# Altium schematic sheet Main.SchDoc
size A4; SheetNumber: 1; SheetTotal: 1
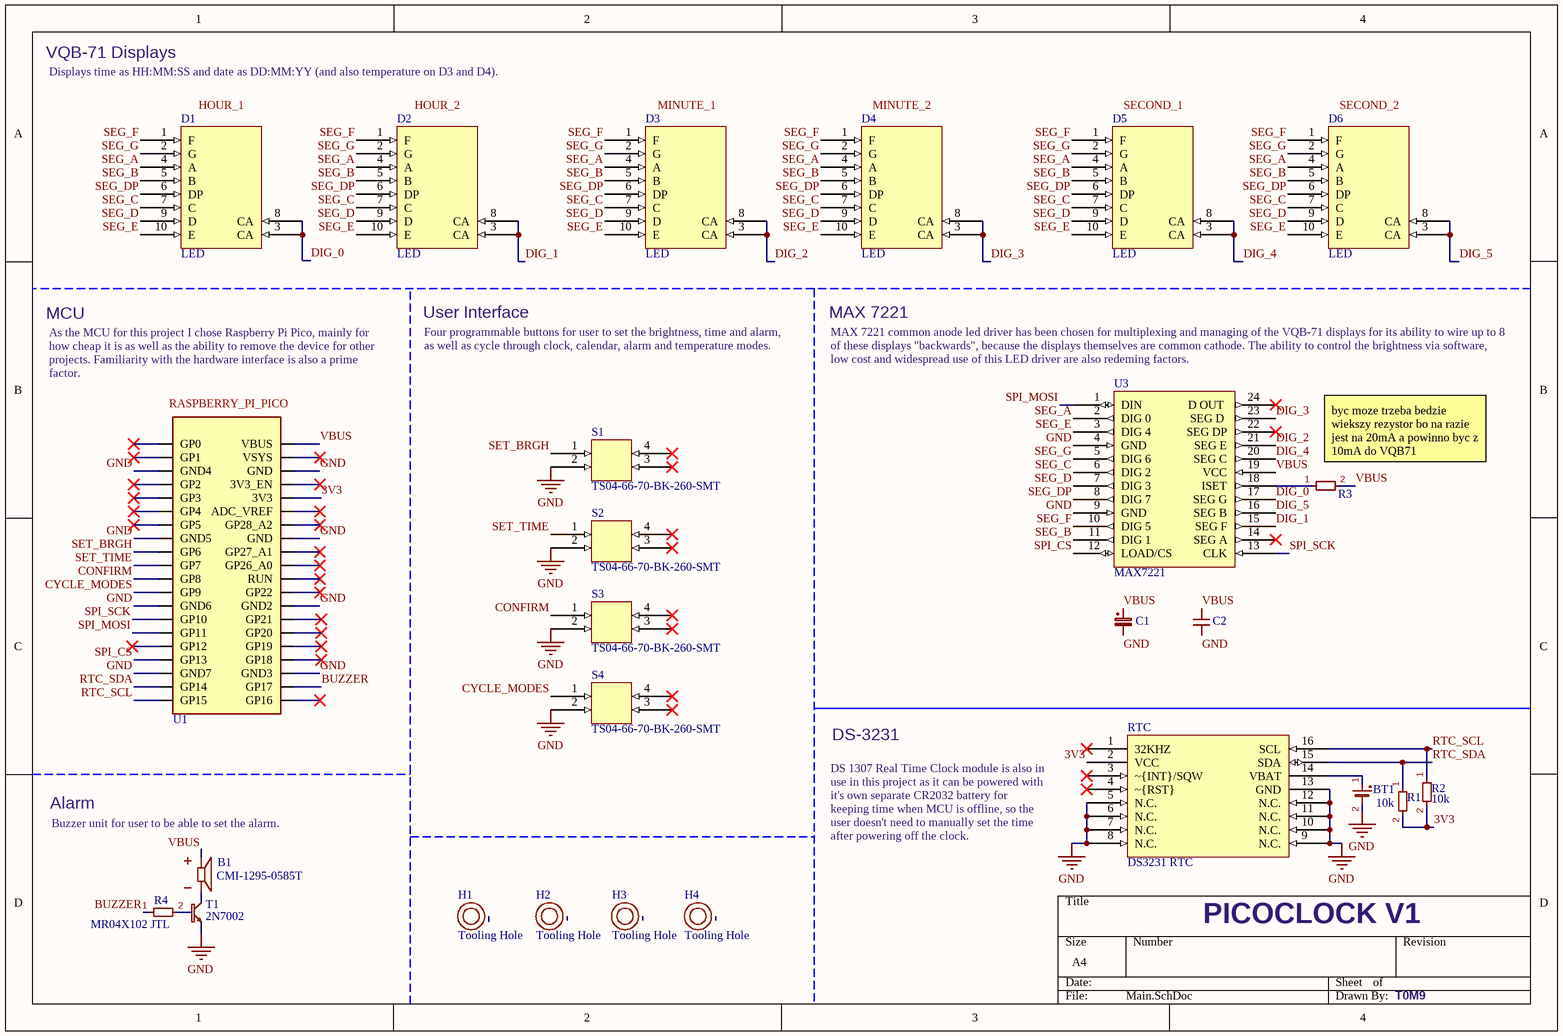
[diagram p0: Main.SchDoc]

## Parts
B1  CMI-1295-0585T  [CMI-1295-0585T]
BT1  Keystone 3034 BH  [BAT_3034TR]  (value not drawn)
C1  Electrolitic Capacitor 10uF  [CAPC2012X145N]  (value not drawn)
C2  UMK105B7104KVHF  [UMK105B7104KVHF]  (value not drawn)
D1  LED  [LED_INND-TS56RAB]
D2  LED  [LED_INND-TS56RAB]
D3  LED  [LED_INND-TS56RAB]
D4  LED  [LED_INND-TS56RAB]
D5  LED  [LED_INND-TS56RAB]
D6  LED  [LED_INND-TS56RAB]
H1  Tooling Hole  [Tooling Hole]
H2  Tooling Hole  [Tooling Hole]
H3  Tooling Hole  [Tooling Hole]
H4  Tooling Hole  [Tooling Hole]
R1  10k  [MR04X102 JTL]
R2  10k  [MR04X102 JTL]
R3  CRCW040221K0FKEDC  [CRCW040221K0FKEDC]  (value not drawn)
R4  MR04X102 JTL  [MR04X102 JTL]
RTC  DS3231 RTC  [DS3231 RTC]
S1  TS04-66-70-BK-260-SMT  [TS04-66-70-BK-260-SMT]
S2  TS04-66-70-BK-260-SMT  [TS04-66-70-BK-260-SMT]
S3  TS04-66-70-BK-260-SMT  [TS04-66-70-BK-260-SMT]
S4  TS04-66-70-BK-260-SMT  [TS04-66-70-BK-260-SMT]
T1  2N7002  [2N7002]
U1  RASPBERRY_PI_PICO  [RASPBERRY_PI_PICO]
U3  MAX7221  [MAX7221]

## Nets
GND: BT1.2 C1.2 C2.2 RTC.5(N.C.) RTC.6(N.C.) RTC.7(N.C.) RTC.8(N.C.) RTC.9(N.C.) RTC.10(N.C.) RTC.11(N.C.) RTC.12(N.C.) RTC.13(GND) S1.2 S2.2 S3.2 S4.2 T1.2(S) U1.GND U1.GND2 U1.GND3 U1.GND4 U1.GND5 U1.GND6 U1.GND7 U3.4(GND) U3.9(GND)
3V3: R1.2 R2.2 RTC.2(VCC) U1.3V3
BUZZER: R4.1 U1.GP17
CONFIRM: S3.1 U1.GP8
CYCLE_MODES: S4.1 U1.GP9
DIG_0: D1.3(CA) D1.8(CA) U3.17(SEG_G)
DIG_1: D2.3(CA) D2.8(CA) U3.15(SEG_F)
DIG_2: D3.3(CA) D3.8(CA) U3.21(SEG_E)
DIG_3: D4.3(CA) D4.8(CA) U3.23(SEG_D)
DIG_4: D5.3(CA) D5.8(CA) U3.20(SEG_C)
DIG_5: D6.3(CA) D6.8(CA) U3.16(SEG_B)
RTC_SCL: R2.1 RTC.16(SCL) U1.GP15
RTC_SDA: R1.1 RTC.15(SDA) U1.GP14
SEG_A: D1.4(A) D2.4(A) D3.4(A) D4.4(A) D5.4(A) D6.4(A) U3.2(DIG_0)
SEG_B: D1.5(B) D2.5(B) D3.5(B) D4.5(B) D5.5(B) D6.5(B) U3.11(DIG_1)
SEG_C: D1.7(C) D2.7(C) D3.7(C) D4.7(C) D5.7(C) D6.7(C) U3.6(DIG_2)
SEG_D: D1.9(D) D2.9(D) D3.9(D) D4.9(D) D5.9(D) D6.9(D) U3.7(DIG_3)
SEG_DP: D1.6(DP) D2.6(DP) D3.6(DP) D4.6(DP) D5.6(DP) D6.6(DP) U3.8(DIG_7)
SEG_E: D1.10(E) D2.10(E) D3.10(E) D4.10(E) D5.10(E) D6.10(E) U3.3(DIG_4)
SEG_F: D1.1(F) D2.1(F) D3.1(F) D4.1(F) D5.1(F) D6.1(F) U3.10(DIG_5)
SEG_G: D1.2(G) D2.2(G) D3.2(G) D4.2(G) D5.2(G) D6.2(G) U3.5(DIG_6)
SET_BRGH: S1.1 U1.GP6
SET_TIME: S2.1 U1.GP7
SPI_CS: U1.GP13 U3.12(LOAD/CS)
SPI_MOSI: U1.GP11 U3.1(DIN)
SPI_SCK: U1.GP10 U3.13(CLK)
VBUS: B1.P C1.1 C2.1 R3.2 U1.VBUS U3.19(VCC)
NetB1_N: B1.N T1.3(D)
NetBT1_1: BT1.1 RTC.14(VBAT)
NetR3_1: R3.1 U3.18(ISET)
NetR4_2: R4.2 T1.1(G)

Not connected (* = marked no-connect by the designer): RTC 1(32KHZ)* 3(~{INT}/SQW)* 4(~{RST})*; S1 3* 4*; S2 3* 4*; S3 3* 4*; S4 3* 4*; U1 3V3_EN* ADC_VREF* GP0* GP1* GP2* GP3* GP4* GP5* GP12* GP16* GP18* GP19* GP20* GP21* GP22* GP26_A0* GP27_A1* GP28_A2* RUN* VSYS*; U3 14(SEG_A)* 22(SEG_DP)* 24(D_OUT_)*

## Notes on the sheet
- VQB-71 Displays
- Displays time as HH:MM:SS and date as DD:MM:YY (and also temperature on D3 and D4).
- (near D1) HOUR_1
- (near D2) HOUR_2
- (near D3) MINUTE_1
- (near D4) MINUTE_2
- (near D5) SECOND_1
- (near D6) SECOND_2
- MCU
- As the MCU for this project I chose Raspberry Pi Pico, mainly for how cheap it is as well as the ability to remove the device for other projects. Familiarity with the hardware interface is also a prime factor.
- User Interface
- Four programmable buttons for user to set the brightness, time and alarm, as well as cycle through clock, calendar, alarm and temperature modes.
- MAX 7221
- (near U3) MAX 7221 common anode led driver has been chosen for multiplexing and managing of the VQB-71 displays for its ability to wire up to 8 of these displays "backwards", because the displays themselves are common cathode. The ability to control the brightness via software, low cost and widespread use of this LED driver are also redeming factors.
- (near R3) byc moze trzeba bedzie wiekszy rezystor bo na razie jest na 20mA a powinno byc z 10mA do VQB71
- DS-3231
- (near B1) Alarm
- (near B1) Buzzer unit for user to be able to set the alarm.
- DS 1307 Real Time Clock module is also in use in this project as it can be powered with it's own separate CR2032 battery for keeping time when MCU is offline, so the user doesn't need to manually set the time after powering off the clock.
- PICOCLOCK V1
- T0M9

## Library data of the parts
B1 = CMI-1295-0585T: Buzzer; ComponentLink1Description: New link; ComponentLink1URL: *
C1 = Electrolitic Capacitor 10uF: CGA4J1X7R0J106K125AC / 10u 6.3V 0805
C2 = UMK105B7104KVHF: 0.1uF
D1-D6 = LED: VQB-71
R1 R2 = ESR01MZPF1002
R3 = CRCW040221K0FKEDC: 21k
R4 = MR04X102 JTL: 1k
S1-S4 = TS04-66-70-BK-260-SMT: 50mA 12VDC; ComponentLink1Description: New link; ComponentLink1URL: https://www.mouser.pl/ProductDetail/Same-Sky/TS04-66-70-BK-260-SMT?qs=A6eO%252BMLsxmRC7sCjYvfBWA%3D%3D&mgh=1&vip=1&utm_id=20540008314&utm_source=google&utm_medium=cpc&utm_marketing_tactic=emeacorp&gad_source=1&gad_campaignid=20549663743&gbraid=0AAAAADn_wf3exhVZw2lg0M8R4AHAX7JAt&gclid=Cj0KCQjw9JLHBhC-ARIsAK4PhcrY2_4ccHUHvV6ZUo_WOC_S4ttDTQDRDZOP9uDgYmQccfZ3msk1KAwaApw5EALw_wcB
T1 = 2N7002: Transistor; ComponentLink1Description: New link; ComponentLink1URL: https://eu.mouser.com/ProductDetail/Vishay-Siliconix/2N7002-T1-E3?qs=jcx%252B0HVgj2Z1J1ac9Hiotg%3D%3D&utm_id=22436684815&utm_source=google&utm_medium=cpc&utm_marketing_tactic=emeacorp&gad_source=1&gad_campaignid=22426729329&gbraid=0AAAAADn_wf1Do64Tw2aIrXe33zOqTl_Om&gclid=Cj0KCQjwl5jHBhDHARIsAB0Yqjw-ZGSpO3dx2dSvGBMt7_r144avYgoIM5zojlC5lH09VKLSqUlBBdAaArJKEALw_wcB
U1 = RASPBERRY_PI_PICO: Raspberry Pi Board, Arm Cortex-M0+; Core Architecture:Arm; Core Sub-Architecture:Cortex-M0+; Kit Contents:Raspberry Pi Pico Board; No. Of Bits:32Bit; Silicon Core Number:Rp2040; Silicon Manufacturer:Raspberry Pi |Raspberry-Pi RASPBERRY PI PICO; SnapEDA_Link: https://www.snapeda.com/parts/RASPBERRY%20PI%20PICO/Raspberry+Pi/view-part/?ref=snap; Package: None; Value: *; MF: Raspberry Pi; MP: RASPBERRY PI PICO; Check_prices: https://www.snapeda.com/parts/RASPBERRY%20PI%20PICO/Raspberry+Pi/view-part/?ref=eda